# EAGLE design PIC32_board (EAGLE 7.5.0)
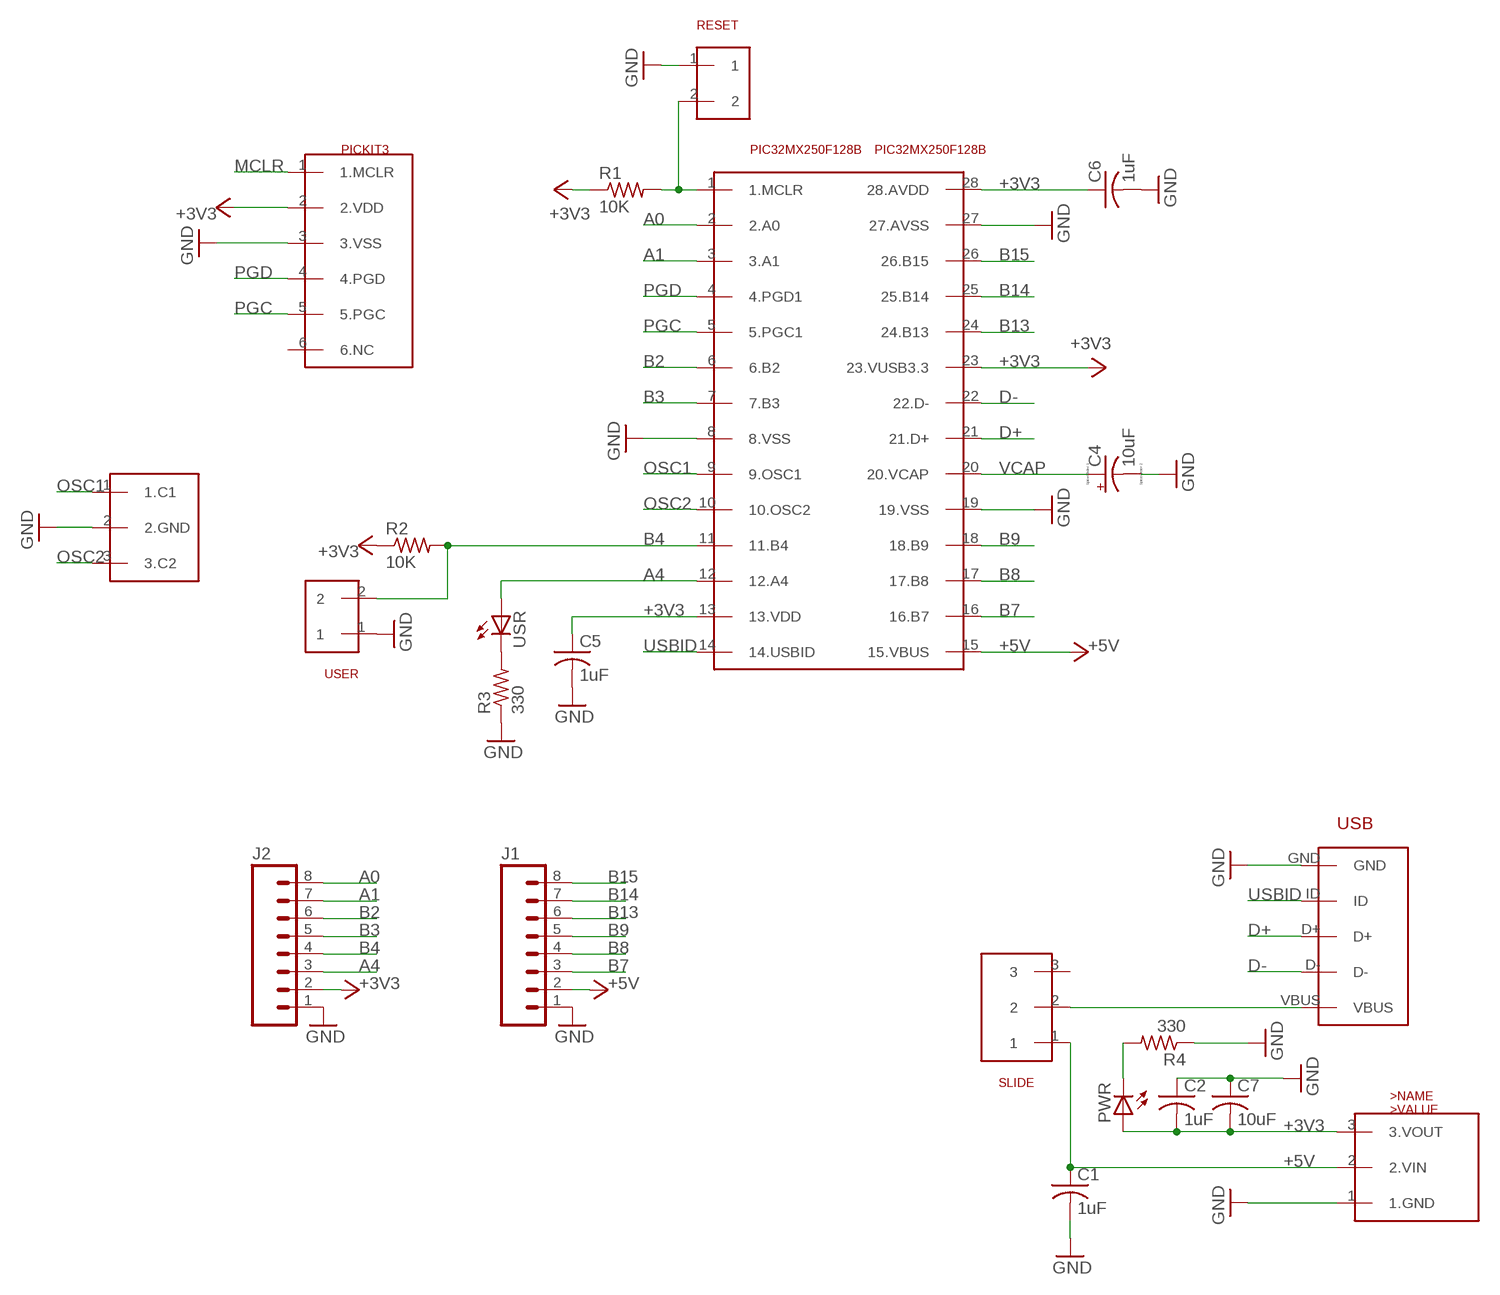
[diagram p0: schematic, sheet 1]

## Parts
C1  1uF  C-US025-024X044  [C025-024X044]
C2  1uF  C-US025-024X044  [C025-024X044]
C4  10uF  CPOL-USB45181B  [B45181B]
C5  1uF  C-US025-024X044  [C025-024X044]
C6  1uF  C-US025-024X044  [C025-024X044]
C7  10uF  C-US025-024X044  [C025-024X044]
J1  M08  [1X08_ROUND]
J2  M08  [1X08_ROUND]
OSC  OSC  [1X03]
PIC32MX250F128B  PIC32MX250F128B  PIC32  [DIL28-3]
PICKIT3  PICKIT3  [1X06]
PWR  LED3MM  [LED3MM]
R1  10K  R-US_0207/10  [0207/10]
R2  10K  R-US_0207/10  [0207/10]
R3  330  R-US_0207/10  [0207/10]
R4  330  R-US_0207/10  [0207/10]
RESET  PUSHBUTTON  [PUSHBUTTON]
SLIDE  SLIDE  [SLIDE]
U$3  MCP1702  [TO92]
USB  USB_5PIN  [USB-MB-H]
USER  PUSHBUTTON  [PUSHBUTTON]
USR  LED3MM  [LED3MM]

## Nets
+3V3: C2.2 C5.1 C6.1 C7.2 J2.2 PIC32MX250F128B.13(13.VDD) PIC32MX250F128B.23(23.VUSB3.3) PIC32MX250F128B.28(28.AVDD) PICKIT3.2(2.VDD) PWR.A R1.1 R2.1 U$3.3(3.VOUT)
+5V: C1.1 J1.2 PIC32MX250F128B.15(15.VBUS) SLIDE.1 U$3.2(2.VIN)
A0: J2.8 PIC32MX250F128B.2(2.A0)
A1: J2.7 PIC32MX250F128B.3(3.A1)
A4: J2.3 PIC32MX250F128B.12(12.A4) USR.A
B2: J2.6 PIC32MX250F128B.6(6.B2)
B3: J2.5 PIC32MX250F128B.7(7.B3)
B4: J2.4 PIC32MX250F128B.11(11.B4) R2.2 USER.2
B7: J1.3 PIC32MX250F128B.16(16.B7)
B8: J1.4 PIC32MX250F128B.17(17.B8)
B9: J1.5 PIC32MX250F128B.18(18.B9)
B13: J1.6 PIC32MX250F128B.24(24.B13)
B14: J1.7 PIC32MX250F128B.25(25.B14)
B15: J1.8 PIC32MX250F128B.26(26.B15)
D+: PIC32MX250F128B.21(21.D+) USB.D+
D-: PIC32MX250F128B.22(22.D-) USB.D-
GND: C1.2 C2.1 C4.- C5.2 C6.2 C7.1 J1.1 J2.1 OSC.2(2.GND) PIC32MX250F128B.8(8.VSS) PIC32MX250F128B.19(19.VSS) PIC32MX250F128B.27(27.AVSS) PICKIT3.3(3.VSS) R3.1 R4.1 RESET.1 U$3.1(1.GND) USB.GND USER.1
MCLR: PIC32MX250F128B.1(1.MCLR) PICKIT3.1(1.MCLR) R1.2 RESET.2
N$1: R3.2 USR.K(C)
N$2: PWR.K(C) R4.2
N$6: SLIDE.2 USB.VBUS
OSC1: OSC.1(1.C1) PIC32MX250F128B.9(9.OSC1)
OSC2: OSC.3(3.C2) PIC32MX250F128B.10(10.OSC2)
PGC: PIC32MX250F128B.5(5.PGC1) PICKIT3.5(5.PGC)
PGD: PIC32MX250F128B.4(4.PGD1) PICKIT3.4(4.PGD)
USBID: PIC32MX250F128B.14(14.USBID) USB.ID
VCAP: C4.+ PIC32MX250F128B.20(20.VCAP)
Unconnected: PICKIT3.6(6.NC) SLIDE.3

## Library data of the parts
C1 C2 C5-C7 = pic32_parts:C-US: CAPACITOR, American symbol
C4 = pic32_parts:CPOL-US: POLARIZED CAPACITOR, American symbol
J1 J2 = pic32_parts:M08: Header 8 Standard 8-pin 0.1" header. Use with straight break away headers (SKU : PRT-00116), right angle break away headers (PRT-00553), swiss pins (PRT-00743), machine pins (PRT-00117), and female headers (PRT-00115).; PROD_ID: CONN-08437
OSC = pic32_parts:OSC
PIC32MX250F128B = pic32_parts:PIC32
PICKIT3 = pic32_parts:PICKIT3
PWR USR = pic32_parts:LED: LED OSRAM: - CHIPLED LG R971, LG N971, LY N971, LG Q971, LY Q971, LO R971, LY R971 LH N974, LH R974 LS Q976, LO Q976, LY Q976 LO Q996 - Hyper CHIPLED LW Q18S LB Q993, LB Q99A, LB R99A - SideLED LS A670, LO A670, LY A670, LG A670, LP A670 LB A673, LV A673, LT A673, LW A673 LH A674 LY A675 LS A676, LA A676, LO A676, LY A676, LW A676 LS A679, LY A679, LG A679 - Hyper Micro SIDELED® LS Y876, LA Y876, LO Y876, LY Y876 LT Y87S - SmartLED LW L88C, LW L88S LB L89C, LB L89S, LG L890 LS L89K, LO L89K, LY L89K LS L896, LA L896, LO L896, LY L896 - TOPLED LS T670, LO T670, LY T670, LG T670, LP T670 LSG T670, LSP T670, LSY T670, LOP T670, LYG T670 LG T671, LOG T671, LSG T671 LB T673, LV T673, LT T673, LW T673 LH T674 LS T676, LA T676, LO T676, LY T676, LB T676, LH T676, LSB T676, LW T676 LB T67C, LV T67C, LT T67C, LS T67K, LO T67K, LY T67K, LW E67C LS E67B, LA E67B, LO E67B, LY E67B, LB E67C, LV E67C, LT E67C LW T67C LS T679, LY T679, LG T679 LS T770, LO T770, LY T770, LG T770, LP T770 LB T773, LV T773, LT T773, LW T773 LH T774 LS E675, LA E675, LY E675, LS T675 LS T776, LA T776, LO T776, LY T776, LB T776 LHGB T686 LT T68C, LB T68C - Hyper Mini TOPLED® LB M676 - Mini TOPLED Santana® LG M470 LS M47K, LO M47K, LY M47K Source: http://www.osram.convergy.de LUXEON: - LUMILED® LXK2-PW12-R00, LXK2-PW12-S00, LXK2-PW14-U00, LXK2-PW14-V00 LXK2-PM12-R00, LXK2-PM12-S00, LXK2-PM14-U00 LXK2-PE12-Q00, LXK2-PE12-R00, LXK2-PE12-S00, LXK2-PE14-T00, LXK2-PE14-U00 LXK2-PB12-K00, LXK2-PB12-L00, LXK2-PB12-M00, LXK2-PB14-N00, LXK2-PB14-P00, LXK2-PB14-Q00 LXK2-PR12-L00, LXK2-PR12-M00, LXK2-PR14-Q00, LXK2-PR14-R00 LXK2-PD12-Q00, LXK2-PD12-R00, LXK2-PD12-S00 LXK2-PH12-R00, LXK2-PH12-S00 LXK2-PL12-P00, LXK2-PL12-Q00, LXK2-PL12-R00 Source: www.luxeon.com KINGBRIGHT: KA-3528ASYC Source: www.kingbright.com
R1-R4 = pic32_parts:R-US_: RESISTOR, American symbol
RESET USER = pic32_parts:PUSHBUTTON
SLIDE = pic32_parts:SLIDE
U$3 = pic32_parts:MCP1702
USB = pic32_parts:USB_5PIN

## Board
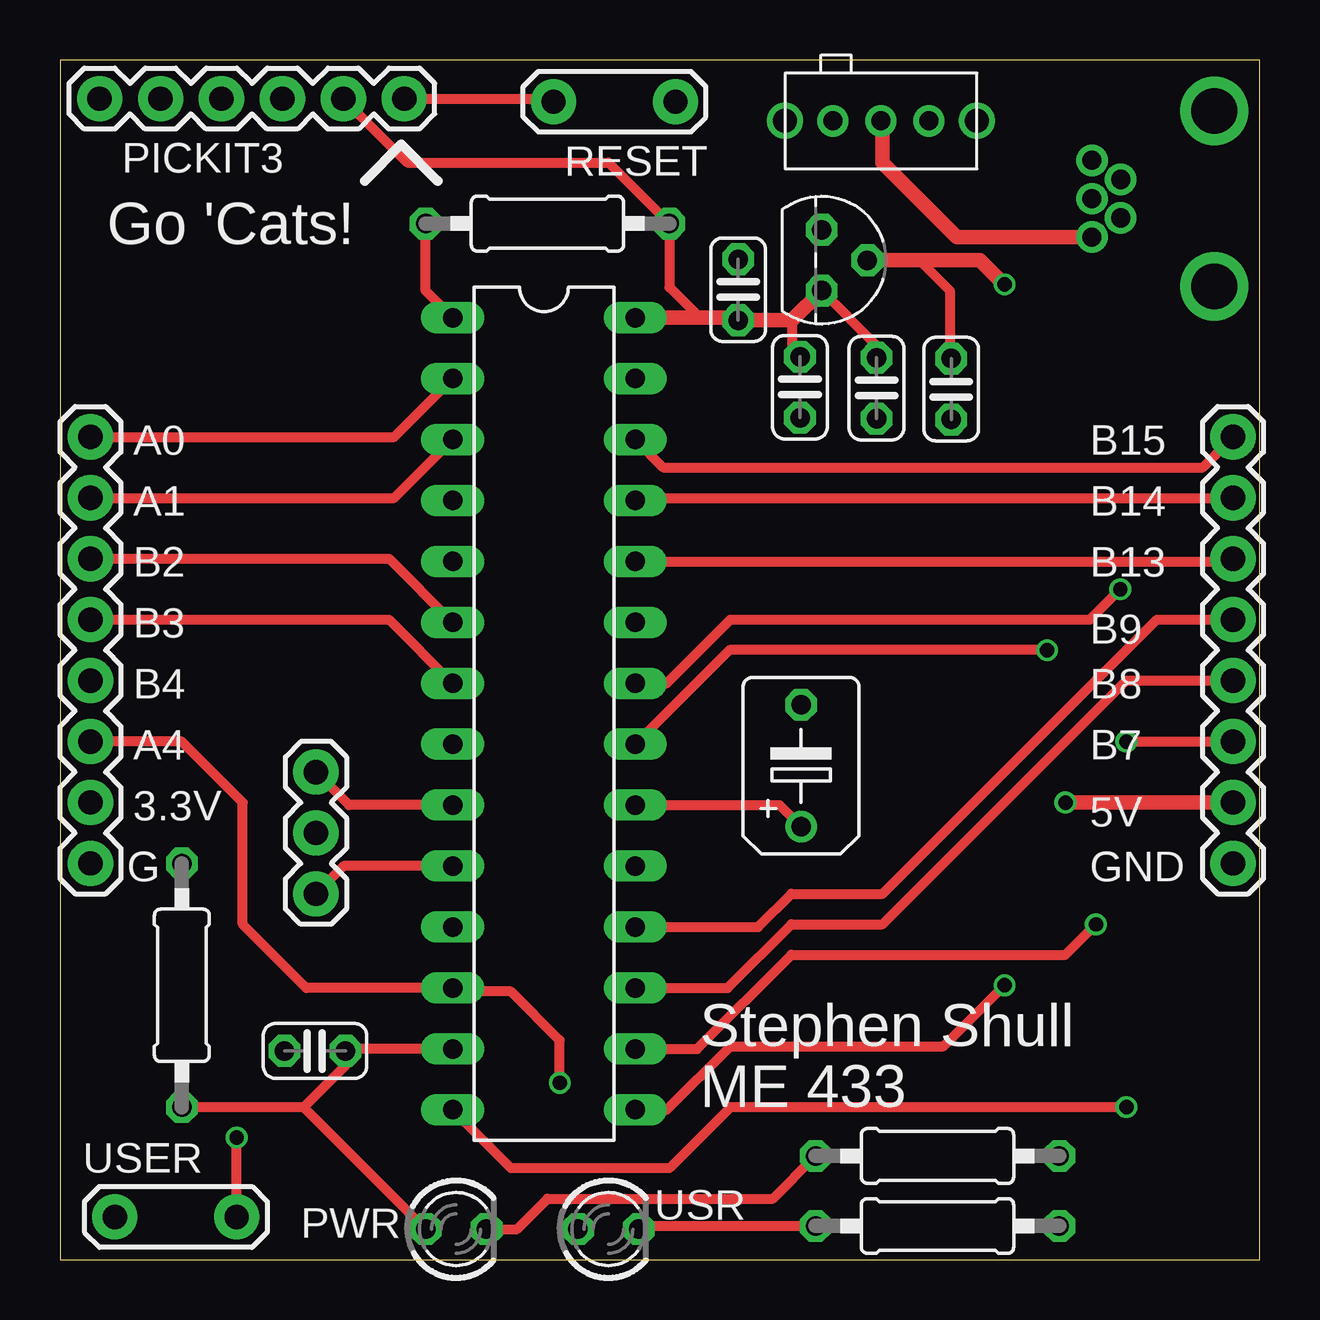
[diagram p1: board, top side]
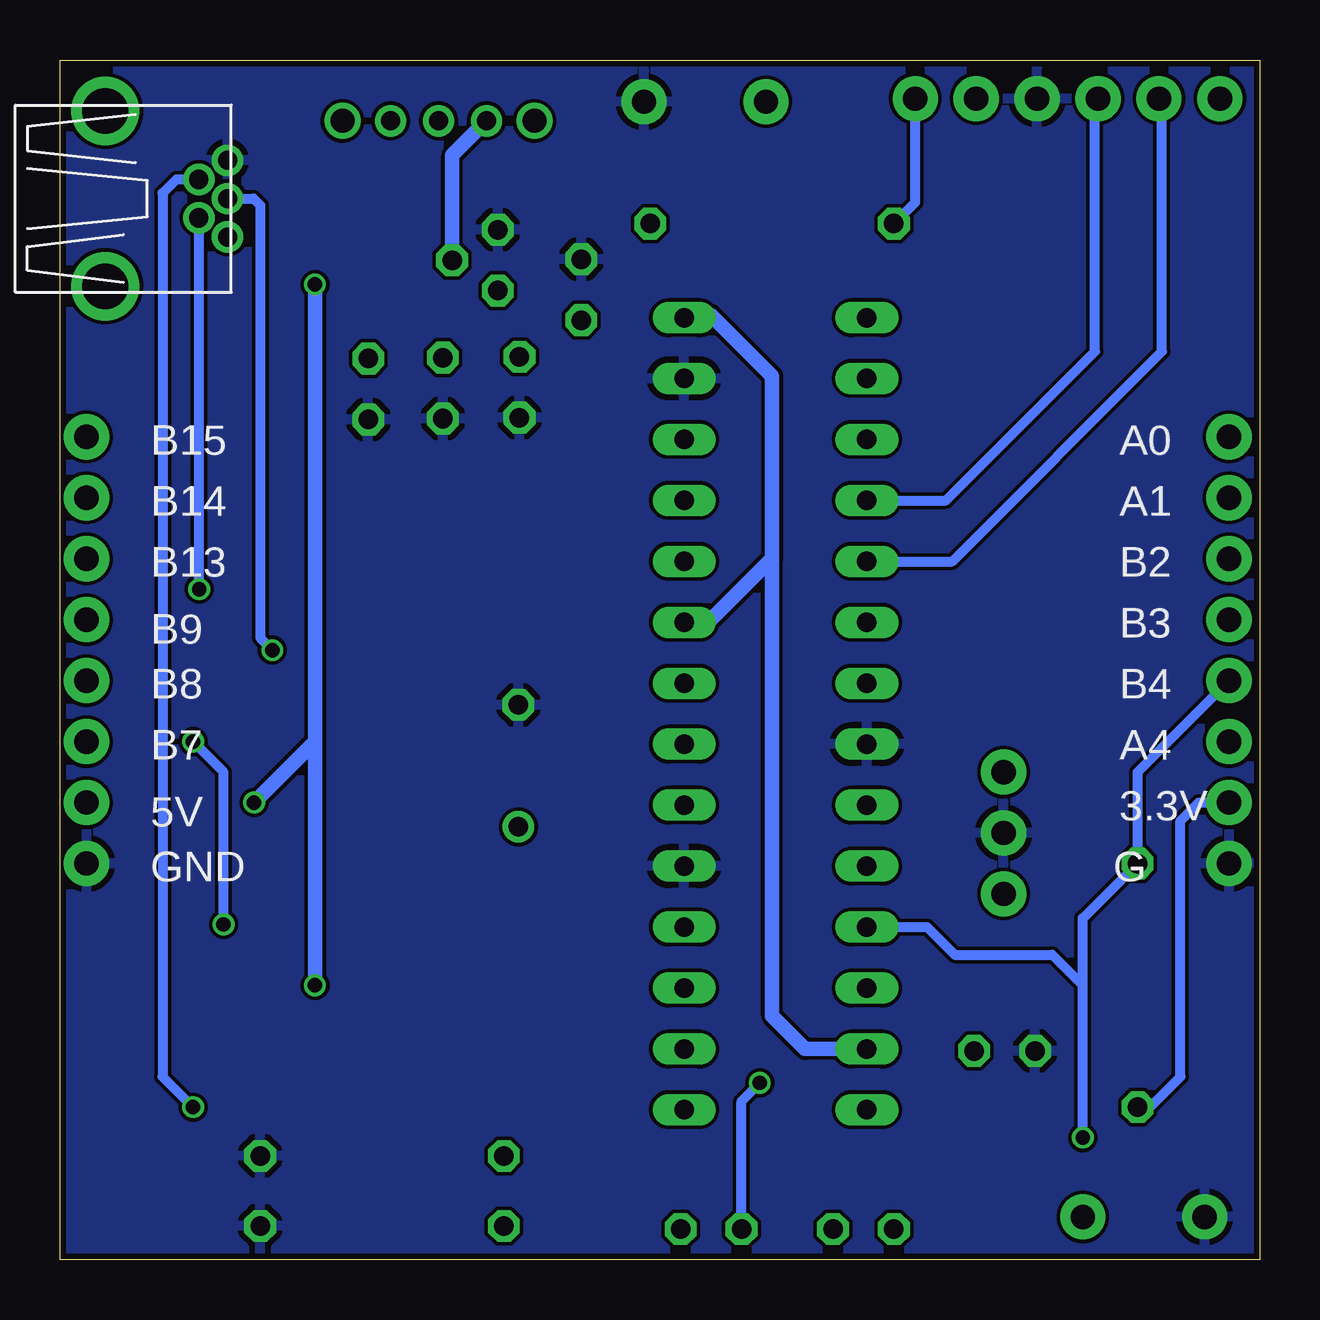
[diagram p2: board, bottom side, seen from below]

Size 50 x 50 mm. Coordinates in mm from the lower left corner, seen from the top.
Outline: 0,0 50,0 50,50 0,50 0,0
Copper layers (1*16): Top 0.035mm / dielectric 1.5mm / Bottom 0.035mm
Design rules "SeeedStudio_2layer_DRU_no_angle_20140221": minimum track width 6mil, minimum drill 12mil, track to track 6mil, track to pad 6mil, pad to pad 6mil, via to via 6mil, smd to smd 0mil, copper to edge 10mil, drill to drill 10mil, minimum pad ring 10mil, minimum via ring 6mil, stop-mask expansion 2mil, vias tented up to drill 100mil, thermal gap 10mil

### Footprints (pad centres in the part's own frame; a part is rotated, then mirrored left to right if it is on the bottom)
C025-024X044 = drill 0.813 octagon: 1 -1.27,0; 2 1.27,0
B45181B = drill 0.813: + -2.54,0 | drill 0.813 octagon: - 2.54,0
1X08_ROUND = drill 1.016 pad 1.88: 1 0,0; 2 2.54,0; 3 5.08,0; 4 7.62,0; 5 10.16,0; 6 12.7,0; 7 15.24,0; 8 17.78,0
1X03 = drill 1.016 pad 1.88: 1 0,0; 2 2.54,0; 3 5.08,0
DIL28-3 = drill 0.813 long: 1 -16.51,-3.81; 2 -13.97,-3.81; 3 -11.43,-3.81; 4 -8.89,-3.81; 5 -6.35,-3.81; 6 -3.81,-3.81; 7 -1.27,-3.81; 8 1.27,-3.81; 9 3.81,-3.81; 10 6.35,-3.81; 11 8.89,-3.81; 12 11.43,-3.81; 13 13.97,-3.81; 14 16.51,-3.81; 15 16.51,3.81; 16 13.97,3.81; 17 11.43,3.81; 18 8.89,3.81; 19 6.35,3.81; 20 3.81,3.81; 21 1.27,3.81; 22 -1.27,3.81; 23 -3.81,3.81; 24 -6.35,3.81; 25 -8.89,3.81; 26 -11.43,3.81; 27 -13.97,3.81; 28 -16.51,3.81
1X06 = drill 1.016 pad 1.88: 1 0,0; 2 2.54,0; 3 5.08,0; 4 7.62,0; 5 10.16,0; 6 12.7,0
LED3MM = drill 0.813 octagon: A -1.27,0; K 1.27,0
0207/10 = drill 0.813 octagon: 1 -5.08,0; 2 5.08,0
PUSHBUTTON = drill 1.016 pad 1.88: 1 0,0; 2 5.08,0
SLIDE = drill 0.8: 1 -2,0; 2 0,0; 3 2,0 | drill 1: P$3 4,0; P$5 -4,0
TO92 = drill 0.813 octagon: 1 -1.27,0; 2 0,1.905; 3 1.27,0
USB-MB-H = drill 0.8: D+ 5.1,0; D- 3.9,0.8; GND 5.1,-1.6; ID 3.9,-0.8; VBUS 5.1,1.6 | drill 1.9: P$6 0,-3.65; P$7 0,3.65

### Placement (x,y rotation side)
C1  37.15,36.28 270 top
C2  30.84,36.36 90 top
C4  30.89,20.58 90 top
C5  10.63,8.7 180 top
C6  28.27,40.42 90 top
C7  34.04,36.32 90 top
J1  48.9,16.51 90 top
J2  1.27,16.51 90 top
OSC  10.67,20.32 270 top
PIC32MX250F128B  20.18,22.75 270 top
PICKIT3  14.35,48.39 180 top
PWR  16.51,1.27 0 top
R1  20.32,43.18 180 top
R2  5.08,11.43 90 top
R3  36.58,1.4 180 top
R4  36.58,4.32 180 top
RESET  25.65,48.26 180 top
SLIDE  34.22,47.47 0 top
U$3  31.75,41.66 270 top
USB  48.11,44.22 180 top
USER  2.29,1.78 0 top
USR  22.86,1.27 0 top

### Tracks (layer width: path | path; a pad name or v marks a point on that pad's centre or on a via)
+3V3
  Top 0.406: 10.16,6.35 11.9,8.09 C5.1 12.07,8.78 PIC32MX250F128B.13 | 10.16,6.35 R2.1 | PICKIT3.2 14.48,45.72 22.86,45.72 R1.1 25.4,40.53 26.67,39.26 | PWR.A 10.16,6.35 | C7.2 34.04,38.1 U$3.3 | 30.52,39.15 30.52,37.96 C2.2
  Top 0.61: PIC32MX250F128B.28 26.67,39.26 28.16,39.26 C6.1 30.52,39.15 U$3.3
  Bottom 0.406: J2.2 2.54,19.05 3.3,18.29 3.3,7.62 4.57,6.35 R2.1
  Bottom 0.61: PIC32MX250F128B.13 18.94,8.78 20.32,10.16 20.32,29.21 | PIC32MX250F128B.28 23.88,39.37 22.86,39.37 20.32,36.83 20.32,29.21 | 20.32,29.21 22.86,26.67 23.88,26.67 PIC32MX250F128B.23
+5V  (via drill 0.6)
  Top 0.406: 35.56,41.66 35.81,41.66 37.08,40.39 37.08,37.62 C1.1 | PIC32MX250F128B.15 25.29,6.24 27.94,8.89 36.83,8.89 v39.37,11.43
  Top 0.61: U$3.2 35.56,41.66 38.35,41.66 v39.37,40.64 | v41.91,19.05 J1.2
  Bottom 0.61: U$3.2 33.66,46.03 SLIDE.1 | v39.37,40.64 39.37,21.59 | 39.37,21.59 v41.91,19.05 | 39.37,21.59 v39.37,11.43
A0
  Top 0.406: J2.8 13.94,34.29 PIC32MX250F128B.2
A1
  Top 0.406: J2.7 13.94,31.75 PIC32MX250F128B.3
A4  (via drill 0.6)
  Top 0.406: v20.83,7.37 20.83,9.14 18.8,11.18 16.51,11.18 PIC32MX250F128B.12 10.27,11.32 7.62,13.97 7.62,19.05 5.08,21.59 J2.3
  Bottom 0.406: USR.A 21.59,6.6 v20.83,7.37
B2
  Top 0.406: J2.6 13.71,29.21 PIC32MX250F128B.6
B3
  Top 0.406: J2.5 13.71,26.67 PIC32MX250F128B.7
B4  (via drill 0.6)
  Top 0.406: USER.2 v7.37,5.08
  Bottom 0.406: 7.37,11.43 7.37,12.7 7.37,14.22 R2.2 5.08,20.32 J2.4 | PIC32MX250F128B.11 13.86,13.86 12.7,12.7 8.64,12.7 7.37,11.43 | v7.37,5.08 7.37,11.43
B7  (via drill 0.6)
  Top 0.406: PIC32MX250F128B.16 26.56,8.78 30.48,12.7 41.91,12.7 v43.18,13.97 | v44.45,21.59 J1.3
  Bottom 0.406: v43.18,13.97 43.18,20.32 v44.45,21.59
B8
  Top 0.406: PIC32MX250F128B.17 27.83,11.32 30.48,13.97 34.29,13.97 44.45,24.13 J1.4
B9
  Top 0.406: PIC32MX250F128B.18 29.1,13.86 30.48,15.24 34.29,15.24 45.72,26.67 J1.5
B13
  Top 0.406: PIC32MX250F128B.24 48.78,29.1 J1.6
B14
  Top 0.406: PIC32MX250F128B.25 24.09,31.75 J1.7
B15
  Top 0.406: PIC32MX250F128B.26 25.14,33.02 47.62,33.02 J1.8
D+  (via drill 0.6)
  Top 0.406: v41.15,25.4 27.91,25.4 PIC32MX250F128B.21
  Bottom 0.406: USB.D+ 41.93,44.22 41.66,43.94 41.66,25.91 v41.15,25.4
D-  (via drill 0.6)
  Top 0.406: PIC32MX250F128B.22 25.29,24.02 27.94,26.67 42.93,26.67 v44.2,27.94
  Bottom 0.406: v44.2,27.94 44.2,43.4 USB.D-
GND
  pour Bottom: -2.54,53.34 53.34,53.34 53.34,50.8 53.34,-5.08 -2.54,-5.08
MCLR
  Top 0.406: PICKIT3.1 20.45,48.39 RESET.2 | PIC32MX250F128B.1 15.24,40.38 R1.2
  Bottom 0.406: R1.2 14.35,44.07 PICKIT3.1
N$1
  Top 0.406: USR.K 24.26,1.4 R3.2
N$2
  Top 0.406: PWR.K 19.05,1.27 20.32,2.54 29.72,2.54 R4.2
N$6
  Top 0.61: USB.VBUS 37.39,42.62 34.29,45.72 34.29,47.4 SLIDE.2
OSC1
  Top 0.406: PIC32MX250F128B.9 12.05,18.94 OSC.1
OSC2
  Top 0.406: PIC32MX250F128B.10 11.83,16.4 OSC.3
PGC
  Bottom 0.406: PIC32MX250F128B.5 12.81,29.1 4.06,37.85 4.06,48.26 PICKIT3.5
PGD
  Bottom 0.406: PIC32MX250F128B.4 13.06,31.64 6.86,37.85 6.86,48.26 PICKIT3.4
USBID  (via drill 0.6)
  Top 0.406: v44.45,6.35 27.94,6.35 25.4,3.81 18.8,3.81 PIC32MX250F128B.14
  Bottom 0.406: USB.ID 45.15,45.02 45.72,44.45 45.72,7.62 v44.45,6.35
VCAP
  Top 0.406: PIC32MX250F128B.20 29.99,18.94 C4.+

### Text on the board
tPlace: Go 'Cats! | A0 | B15 | A1 | B14 | B2 | B13 | B3 | B9 | B4 | B8 | A4 | B7 | 3.3V | 5V | G | GND | Stephen Shull | ME 433 | /Users/stephenshull/Desktop/Beaver-Outline.bmp
bPlace: A0 | B15 | A1 | B14 | B2 | B13 | B3 | B9 | B4 | B8 | A4 | B7 | 3.3V | 5V | G | GND